# Altium schematic sheet Row_IC.SchDoc
size A4
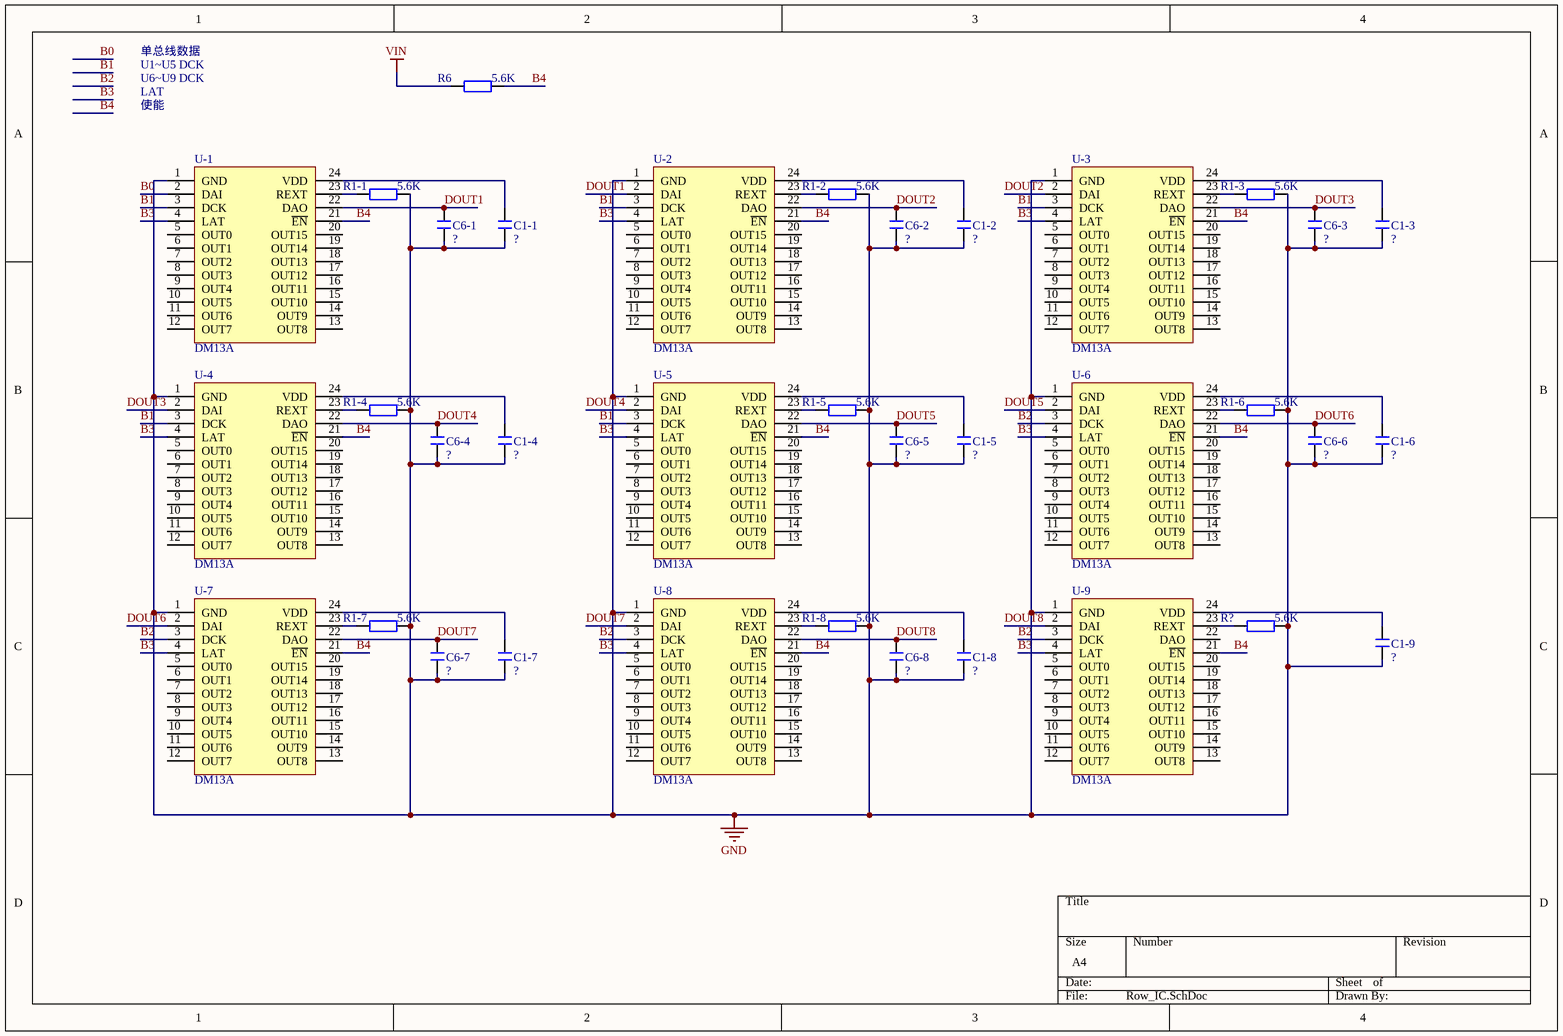
[diagram p0: Row_IC.SchDoc]

## Parts
C1-1  ?  [C 0805_L]
C1-2  ?  [C 0805_L]
C1-3  ?  [C 0805_L]
C1-4  ?  [C 0805_L]
C1-5  ?  [C 0805_L]
C1-6  ?  [C 0805_L]
C1-7  ?  [C 0805_L]
C1-8  ?  [C 0805_L]
C1-9  ?  [C 0805_L]
C6-1  ?  [C 0603_L]
C6-2  ?  [C 0603_L]
C6-3  ?  [C 0603_L]
C6-4  ?  [C 0603_L]
C6-5  ?  [C 0603_L]
C6-6  ?  [C 0603_L]
C6-7  ?  [C 0603_L]
C6-8  ?  [C 0603_L]
R1-1  5.6K  [R 0805_L]
R1-2  5.6K  [R 0805_L]
R1-3  5.6K  [R 0805_L]
R1-4  5.6K  [R 0805_L]
R1-5  5.6K  [R 0805_L]
R1-6  5.6K  [R 0805_L]
R1-7  5.6K  [R 0805_L]
R1-8  5.6K  [R 0805_L]
R6  5.6K  [R 0805_L]
R?  5.6K  [R 0805_L]
U-1  DM13A  [TSSOP24_M]
U-2  DM13A  [TSSOP24_M]
U-3  DM13A  [TSSOP24_M]
U-4  DM13A  [TSSOP24_M]
U-5  DM13A  [TSSOP24_M]
U-6  DM13A  [TSSOP24_M]
U-7  DM13A  [TSSOP24_M]
U-8  DM13A  [TSSOP24_M]
U-9  DM13A  [TSSOP24_M]

## Nets
GND: C1-1.2 C1-2.2 C1-3.2 C1-4.2 C1-5.2 C1-6.2 C1-7.2 C1-8.2 C1-9.2 C6-1.1 C6-2.1 C6-3.1 C6-4.1 C6-5.1 C6-6.1 C6-7.1 C6-8.1 R1-1.2 R1-2.2 R1-3.2 R1-4.2 R1-5.2 R1-6.2 R1-7.2 R1-8.2 R?.2 U-1.1(GND) U-2.1(GND) U-3.1(GND) U-4.1(GND) U-5.1(GND) U-6.1(GND) U-7.1(GND) U-8.1(GND) U-9.1(GND)
VIN: R6.1
B0: U-1.2(DAI)
B1: U-1.3(DCK) U-2.3(DCK) U-3.3(DCK) U-4.3(DCK) U-5.3(DCK)
B2: U-6.3(DCK) U-7.3(DCK) U-8.3(DCK) U-9.3(DCK)
B3: U-1.4(LAT) U-2.4(LAT) U-3.4(LAT) U-4.4(LAT) U-5.4(LAT) U-6.4(LAT) U-7.4(LAT) U-8.4(LAT) U-9.4(LAT)
B4: R6.2 U-1.21(~{EN}) U-2.21(~{EN}) U-3.21(~{EN}) U-4.21(~{EN}) U-5.21(~{EN}) U-6.21(~{EN}) U-7.21(~{EN}) U-8.21(~{EN}) U-9.21(~{EN})
DOUT1: C6-1.2 U-1.22(DAO) U-2.2(DAI)
DOUT2: C6-2.2 U-2.22(DAO) U-3.2(DAI)
DOUT3: C6-3.2 U-3.22(DAO) U-4.2(DAI)
DOUT4: C6-4.2 U-4.22(DAO) U-5.2(DAI)
DOUT5: C6-5.2 U-5.22(DAO) U-6.2(DAI)
DOUT6: C6-6.2 U-6.22(DAO) U-7.2(DAI)
DOUT7: C6-7.2 U-7.22(DAO) U-8.2(DAI)
DOUT8: C6-8.2 U-8.22(DAO) U-9.2(DAI)
NetC1-1_1: C1-1.1 U-1.24(VDD)
NetC1-2_1: C1-2.1 U-2.24(VDD)
NetC1-3_1: C1-3.1 U-3.24(VDD)
NetC1-4_1: C1-4.1 U-4.24(VDD)
NetC1-5_1: C1-5.1 U-5.24(VDD)
NetC1-6_1: C1-6.1 U-6.24(VDD)
NetC1-7_1: C1-7.1 U-7.24(VDD)
NetC1-8_1: C1-8.1 U-8.24(VDD)
NetC1-9_1: C1-9.1 U-9.24(VDD)
NetR1-1_1: R1-1.1 U-1.23(REXT)
NetR1-2_1: R1-2.1 U-2.23(REXT)
NetR1-3_1: R1-3.1 U-3.23(REXT)
NetR1-4_1: R1-4.1 U-4.23(REXT)
NetR1-5_1: R1-5.1 U-5.23(REXT)
NetR1-6_1: R1-6.1 U-6.23(REXT)
NetR1-7_1: R1-7.1 U-7.23(REXT)
NetR1-8_1: R1-8.1 U-8.23(REXT)
NetR?_1: R?.1 U-9.23(REXT)

Not connected (* = marked no-connect by the designer): U-1 5(OUT0) 6(OUT1) 7(OUT2) 8(OUT3) 9(OUT4) 10(OUT5) 11(OUT6) 12(OUT7) 13(OUT8) 14(OUT9) 15(OUT10) 16(OUT11) 17(OUT12) 18(OUT13) 19(OUT14) 20(OUT15); U-2 5(OUT0) 6(OUT1) 7(OUT2) 8(OUT3) 9(OUT4) 10(OUT5) 11(OUT6) 12(OUT7) 13(OUT8) 14(OUT9) 15(OUT10) 16(OUT11) 17(OUT12) 18(OUT13) 19(OUT14) 20(OUT15); U-3 5(OUT0) 6(OUT1) 7(OUT2) 8(OUT3) 9(OUT4) 10(OUT5) 11(OUT6) 12(OUT7) 13(OUT8) 14(OUT9) 15(OUT10) 16(OUT11) 17(OUT12) 18(OUT13) 19(OUT14) 20(OUT15); U-4 5(OUT0) 6(OUT1) 7(OUT2) 8(OUT3) 9(OUT4) 10(OUT5) 11(OUT6) 12(OUT7) 13(OUT8) 14(OUT9) 15(OUT10) 16(OUT11) 17(OUT12) 18(OUT13) 19(OUT14) 20(OUT15); U-5 5(OUT0) 6(OUT1) 7(OUT2) 8(OUT3) 9(OUT4) 10(OUT5) 11(OUT6) 12(OUT7) 13(OUT8) 14(OUT9) 15(OUT10) 16(OUT11) 17(OUT12) 18(OUT13) 19(OUT14) 20(OUT15); U-6 5(OUT0) 6(OUT1) 7(OUT2) 8(OUT3) 9(OUT4) 10(OUT5) 11(OUT6) 12(OUT7) 13(OUT8) 14(OUT9) 15(OUT10) 16(OUT11) 17(OUT12) 18(OUT13) 19(OUT14) 20(OUT15); U-7 5(OUT0) 6(OUT1) 7(OUT2) 8(OUT3) 9(OUT4) 10(OUT5) 11(OUT6) 12(OUT7) 13(OUT8) 14(OUT9) 15(OUT10) 16(OUT11) 17(OUT12) 18(OUT13) 19(OUT14) 20(OUT15); U-8 5(OUT0) 6(OUT1) 7(OUT2) 8(OUT3) 9(OUT4) 10(OUT5) 11(OUT6) 12(OUT7) 13(OUT8) 14(OUT9) 15(OUT10) 16(OUT11) 17(OUT12) 18(OUT13) 19(OUT14) 20(OUT15); U-9 5(OUT0) 6(OUT1) 7(OUT2) 8(OUT3) 9(OUT4) 10(OUT5) 11(OUT6) 12(OUT7) 13(OUT8) 14(OUT9) 15(OUT10) 16(OUT11) 17(OUT12) 18(OUT13) 19(OUT14) 20(OUT15) 22(DAO)

## Notes on the sheet
- 单总线数据
- U1~U5 DCK
- U6~U9 DCK
- LAT
- 使能

## Library data of the parts
C1-1-C1-9 C6-1-C6-8 = C: 无极性贴片电容; 版权归属: 源创客; BOM名称: 无极性贴片电容; 学习资源: www.ooocke.com
R1-1-R1-8 R6 R? = R: 贴片电阻; 版权归属: 源创客; BOM名称: 贴片电阻; 学习资源: www.ooocke.com